# Altium schematic sheet Khoi_Switch.SchDoc
size A; SheetNumber: 3; SheetTotal: 3
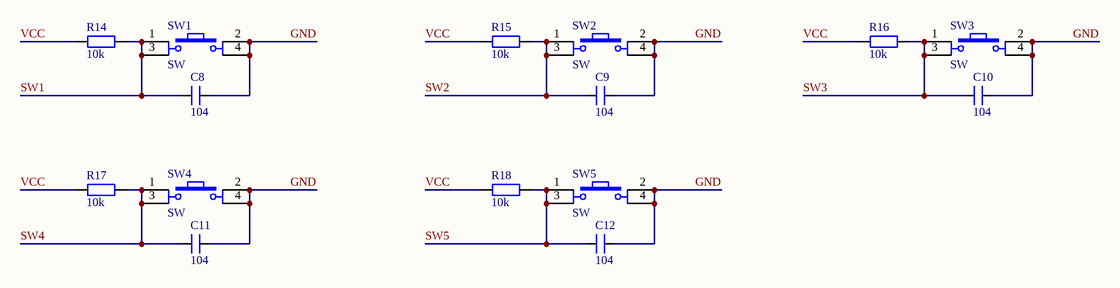
[diagram p0: Khoi_Switch.SchDoc]

## Parts
C8  104  [CN2]
C9  104  [CN2]
C10  104  [CN2]
C11  104  [CN2]
C12  104  [CN2]
R14  10k  [R1/4W]
R15  10k  [R1/4W]
R16  10k  [R1/4W]
R17  10k  [R1/4W]
R18  10k  [R1/4W]
SW1  SW  [SW4]
SW2  SW  [SW4]
SW3  SW  [SW4]
SW4  SW  [SW4]
SW5  SW  [SW4]

## Nets
GND: C8.2 C9.2 C10.2 C11.2 C12.2 SW1.2 SW1.4 SW2.2 SW2.4 SW3.2 SW3.4 SW4.2 SW4.4 SW5.2 SW5.4
SW1: C8.1 R14.2 SW1.1 SW1.3
SW2: C9.1 R15.2 SW2.1 SW2.3
SW3: C10.1 R16.2 SW3.1 SW3.3
SW4: C11.1 R17.2 SW4.1 SW4.3
SW5: C12.1 R18.2 SW5.1 SW5.3
VCC: R14.1 R15.1 R16.1 R17.1 R18.1

## Library data of the parts
C8-C12 = CN2: Cap np 104 => 105pF; Value: 0.1uF
R14-R18 = R1/4W: Resistor 1/4W; Value: R1/4W - 1K
SW1-SW5 = SW4: Switch button 4 pin; Value: Button chip 4 pin